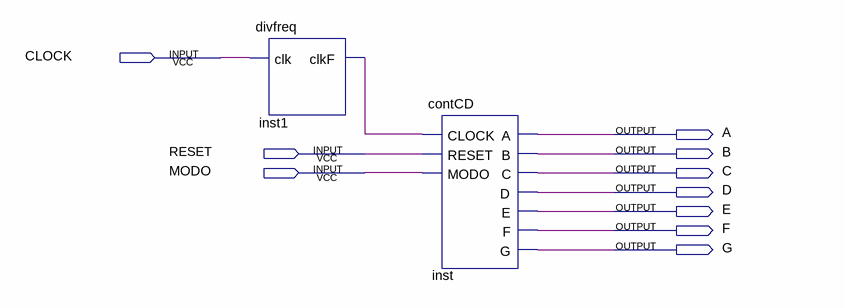
[diagram p0: schematic sheet]
// Quartus schematic contAut.bdf as structural Verilog: 2 symbols, 10 pins
module contAut (
  input  CLOCK,
  input  RESET,
  input  MODO,
  output A,
  output B,
  output C,
  output D,
  output E,
  output F,
  output G
);

  wire inst1_clkf;

  divfreq inst1 (.clk(CLOCK), .clkF(inst1_clkf));
  contCD inst (.CLOCK(inst1_clkf), .RESET(RESET), .MODO(MODO), .A(A), .B(B), .C(C), .D(D), .E(E), .F(F), .G(G));
endmodule
